# Altium schematic sheet power.SchDoc
size A4; SheetNumber: 4; SheetTotal: 5
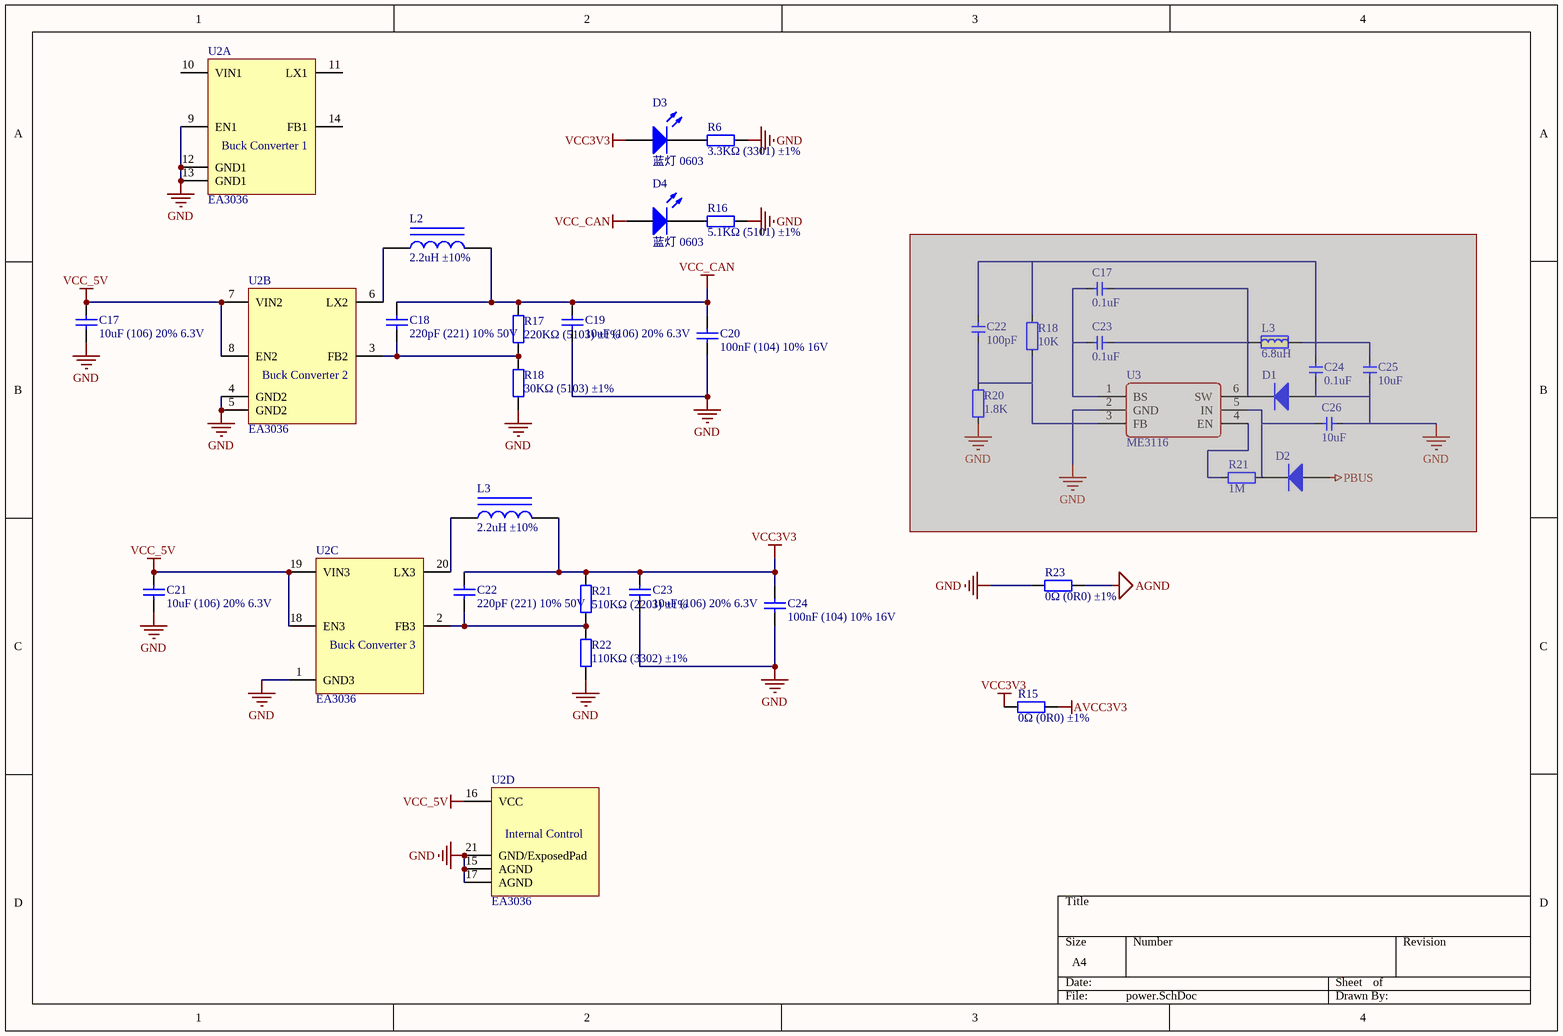
[diagram p0: power.SchDoc]

## Parts
(Parts that share a designator on the sheet are numbered #1, #2 ... from top to bottom, then left to right.)
C17#1  0.1uF  [CAP_0402]  (masked out: inside a compile mask, not in the netlist)
C17#2  10uF (106) 20% 6.3V  [LC-0402_C]
C18  220pF (221) 10% 50V  [LC-0402_C]
C19  10uF (106) 20% 6.3V  [LC-0402_C]
C20  100nF (104) 10% 16V  [LC-0402_C]
C21  10uF (106) 20% 6.3V  [LC-0402_C]
C22#1  100pF  [CAP_0402]  (masked out: inside a compile mask, not in the netlist)
C22#2  220pF (221) 10% 50V  [LC-0402_C]
C23#1  0.1uF  [CAP_0402]  (masked out: inside a compile mask, not in the netlist)
C23#2  10uF (106) 20% 6.3V  [LC-0402_C]
C24#1  0.1uF  [CAP_0402]  (masked out: inside a compile mask, not in the netlist)
C24#2  100nF (104) 10% 16V  [LC-0402_C]
C25  10uF  [CAP_0402]  (masked out: inside a compile mask, not in the netlist)
C26  10uF  [CAP_0402]  (masked out: inside a compile mask, not in the netlist)
D1  二极管-5B5819WS  [SOD-323]  (value not drawn)  (masked out: inside a compile mask, not in the netlist)
D2  二极管-5B5819WS  [SOD-323]  (value not drawn)  (masked out: inside a compile mask, not in the netlist)
D3  蓝灯 0603  [LC-0603_LED_S1]
D4  蓝灯 0603  [LC-0603_LED_S1]
L2  2.2uH ±10%  [LC-0805_L]
L3#1  6.8uH  [IND-201612]  (masked out: inside a compile mask, not in the netlist)
L3#2  2.2uH ±10%  [LC-0805_L]
R6  3.3KΩ (3301) ±1%  [LC-0402_R]
R15  0Ω (0R0) ±1%  [LC-0402_R]
R16  5.1KΩ (5101) ±1%  [LC-0402_R]
R17  220KΩ (5103) ±1%  [LC-0402_R]
R18#1  10K  [RES_0402]  (masked out: inside a compile mask, not in the netlist)
R18#2  30KΩ (5103) ±1%  [LC-0402_R]
R20  1.8K  [RES_0402]  (masked out: inside a compile mask, not in the netlist)
R21#1  1M  [RES_0402]  (masked out: inside a compile mask, not in the netlist)
R21#2  510KΩ (2203) ±1%  [LC-0402_R]
R22  110KΩ (3302) ±1%  [LC-0402_R]
R23  0Ω (0R0) ±1%  [LC-0402_R]
U2  EA3036  [QFN-20]  (parts A,B,C,D of 4)
U3  ME3116  [SOT23-6]  (masked out: inside a compile mask, not in the netlist)

## Nets
AGND: R23.2
AVCC3V3: R15.2
GND: C17#2.1 C19.1 C20.1 C21.1 C23#2.1 C24#2.1 R6.2 R16.2 R18#2.1 R22.1 R23.1 U2.1(GND3) U2.4(GND2) U2.5(GND2) U2.9(EN1) U2.12(GND1) U2.13(GND1) U2.15(AGND) U2.17(AGND) U2.21(GND/ExposedPad)
VCC3V3: C22#2.2 C23#2.2 C24#2.2 D3.A L3#2.2 R15.1 R21#2.2
VCC_5V: C17#2.2 C21.2 U2.7(VIN2) U2.8(EN2) U2.16(VCC) U2.18(EN3) U2.19(VIN3)
VCC_CAN: C18.2 C19.2 C20.2 D4.A L2.2 R17.2
NetC18_1: C18.1 R17.1 R18#2.2 U2.3(FB2)
NetC22#2_1: C22#2.1 R21#2.1 R22.2 U2.2(FB3)
NetD3_K: D3.K R6.1
NetD4_K: D4.K R16.1
NetL2_1: L2.1 U2.6(LX2)
NetL3#2_1: L3#2.1 U2.20(LX3)

Not connected (* = marked no-connect by the designer): U2 10(VIN1) 11(LX1) 14(FB1)

## Notes on the sheet
- (in symbol EA3036, part A) Buck Converter 1
- (in symbol EA3036, part B) Buck Converter 2
- (in symbol EA3036, part C) Buck Converter 3
- (in symbol EA3036, part D) Internal Control

## Library data of the parts
C17#1 C22#1 C23#1 C24#1 C25 C26 = 电容-0402: Capacitor; Value: 0.1u
C17#2 C19 C21 C23#2 = 0402 10uF (106) 20% 6.3V: 贴片电容; ComponentLink1Description: 供应商链接; ComponentLink1URL: http://www.szlcsc.com/product/details_16204.html; Package: 0402; Supplier: LC; SuppliersPartNumber: C15525
C18 C22#2 = 0402 220pF (221) 10% 50V: 贴片电容; ComponentLink1Description: 供应商链接; ComponentLink1URL: http://www.szlcsc.com/product/details_1882.html; Package: 0402; Supplier: LC; SuppliersPartNumber: C1530
C20 C24#2 = 0402 100nF (104) 10% 16V: 贴片电容; ComponentLink1Description: 供应商链接; ComponentLink1URL: http://www.szlcsc.com/product/details_1877.html; Package: 0402; Supplier: LC; SuppliersPartNumber: C1525
D1 D2 = 二极管-5B5817WS: 40V
D3 D4 = 0603 蓝灯: 发光二极管; ComponentLink1Description: 供应商链接; ComponentLink1URL: http://www.szlcsc.com/product/details_73150.html; Package: 0603; Supplier: LC; SuppliersPartNumber: C72041
L2 L3#2 = 0805 2.2uH 10%: 贴片电感; ComponentLink1Description: 供应商链接; ComponentLink1URL: http://www.szlcsc.com/product/details_1395.html; Package: 0805; Supplier: LC; SuppliersPartNumber: C1043
L3#1 = 电感-201612
R6 = 0402 3.3KΩ (3301) 1%: 贴片电阻; ComponentLink1Description: 供应商链接; ComponentLink1URL: http://www.szlcsc.com/product/details_26633.html; Package: 0402; Supplier: LC; SuppliersPartNumber: C25890
R15 R23 = 0402 0Ω (0R0) 1%: 贴片电阻; ComponentLink1Description: 供应商链接; ComponentLink1URL: http://www.szlcsc.com/product/details_17853.html; Package: 0402; Supplier: LC; SuppliersPartNumber: C17168
R16 = 0402 5.1KΩ (5101) 1%: 贴片电阻; ComponentLink1Description: 供应商链接; ComponentLink1URL: http://www.szlcsc.com/product/details_26648.html; Package: 0402; Supplier: LC; SuppliersPartNumber: C25905
R17 R18#2 = 0402 510KΩ (5103) 1%: 贴片电阻; ComponentLink1Description: 供应商链接; ComponentLink1URL: http://www.szlcsc.com/product/details_12170.html; Package: 0402; Supplier: LC; SuppliersPartNumber: C11616
R18#1 R20 R21#1 = 电阻-0402: Resistor; Value: 22R
R21#2 = 0402 220KΩ (2203) 1%: 贴片电阻; ComponentLink1Description: 供应商链接; ComponentLink1URL: http://www.szlcsc.com/product/details_26510.html; Package: 0402; Supplier: LC; SuppliersPartNumber: C25767
R22 = 0402 33KΩ (3302) 1%: 贴片电阻; ComponentLink1Description: 供应商链接; ComponentLink1URL: http://www.szlcsc.com/product/details_26522.html; Package: 0402; Supplier: LC; SuppliersPartNumber: C25779
U2 = EA3036: EA3036 is a 3CH power management IC for applications powered by one Li-Ion battery or a DC 5V adapter.
U3 = ME3116: DC-DC